# EAGLE design bare (EAGLE 9.3.2)
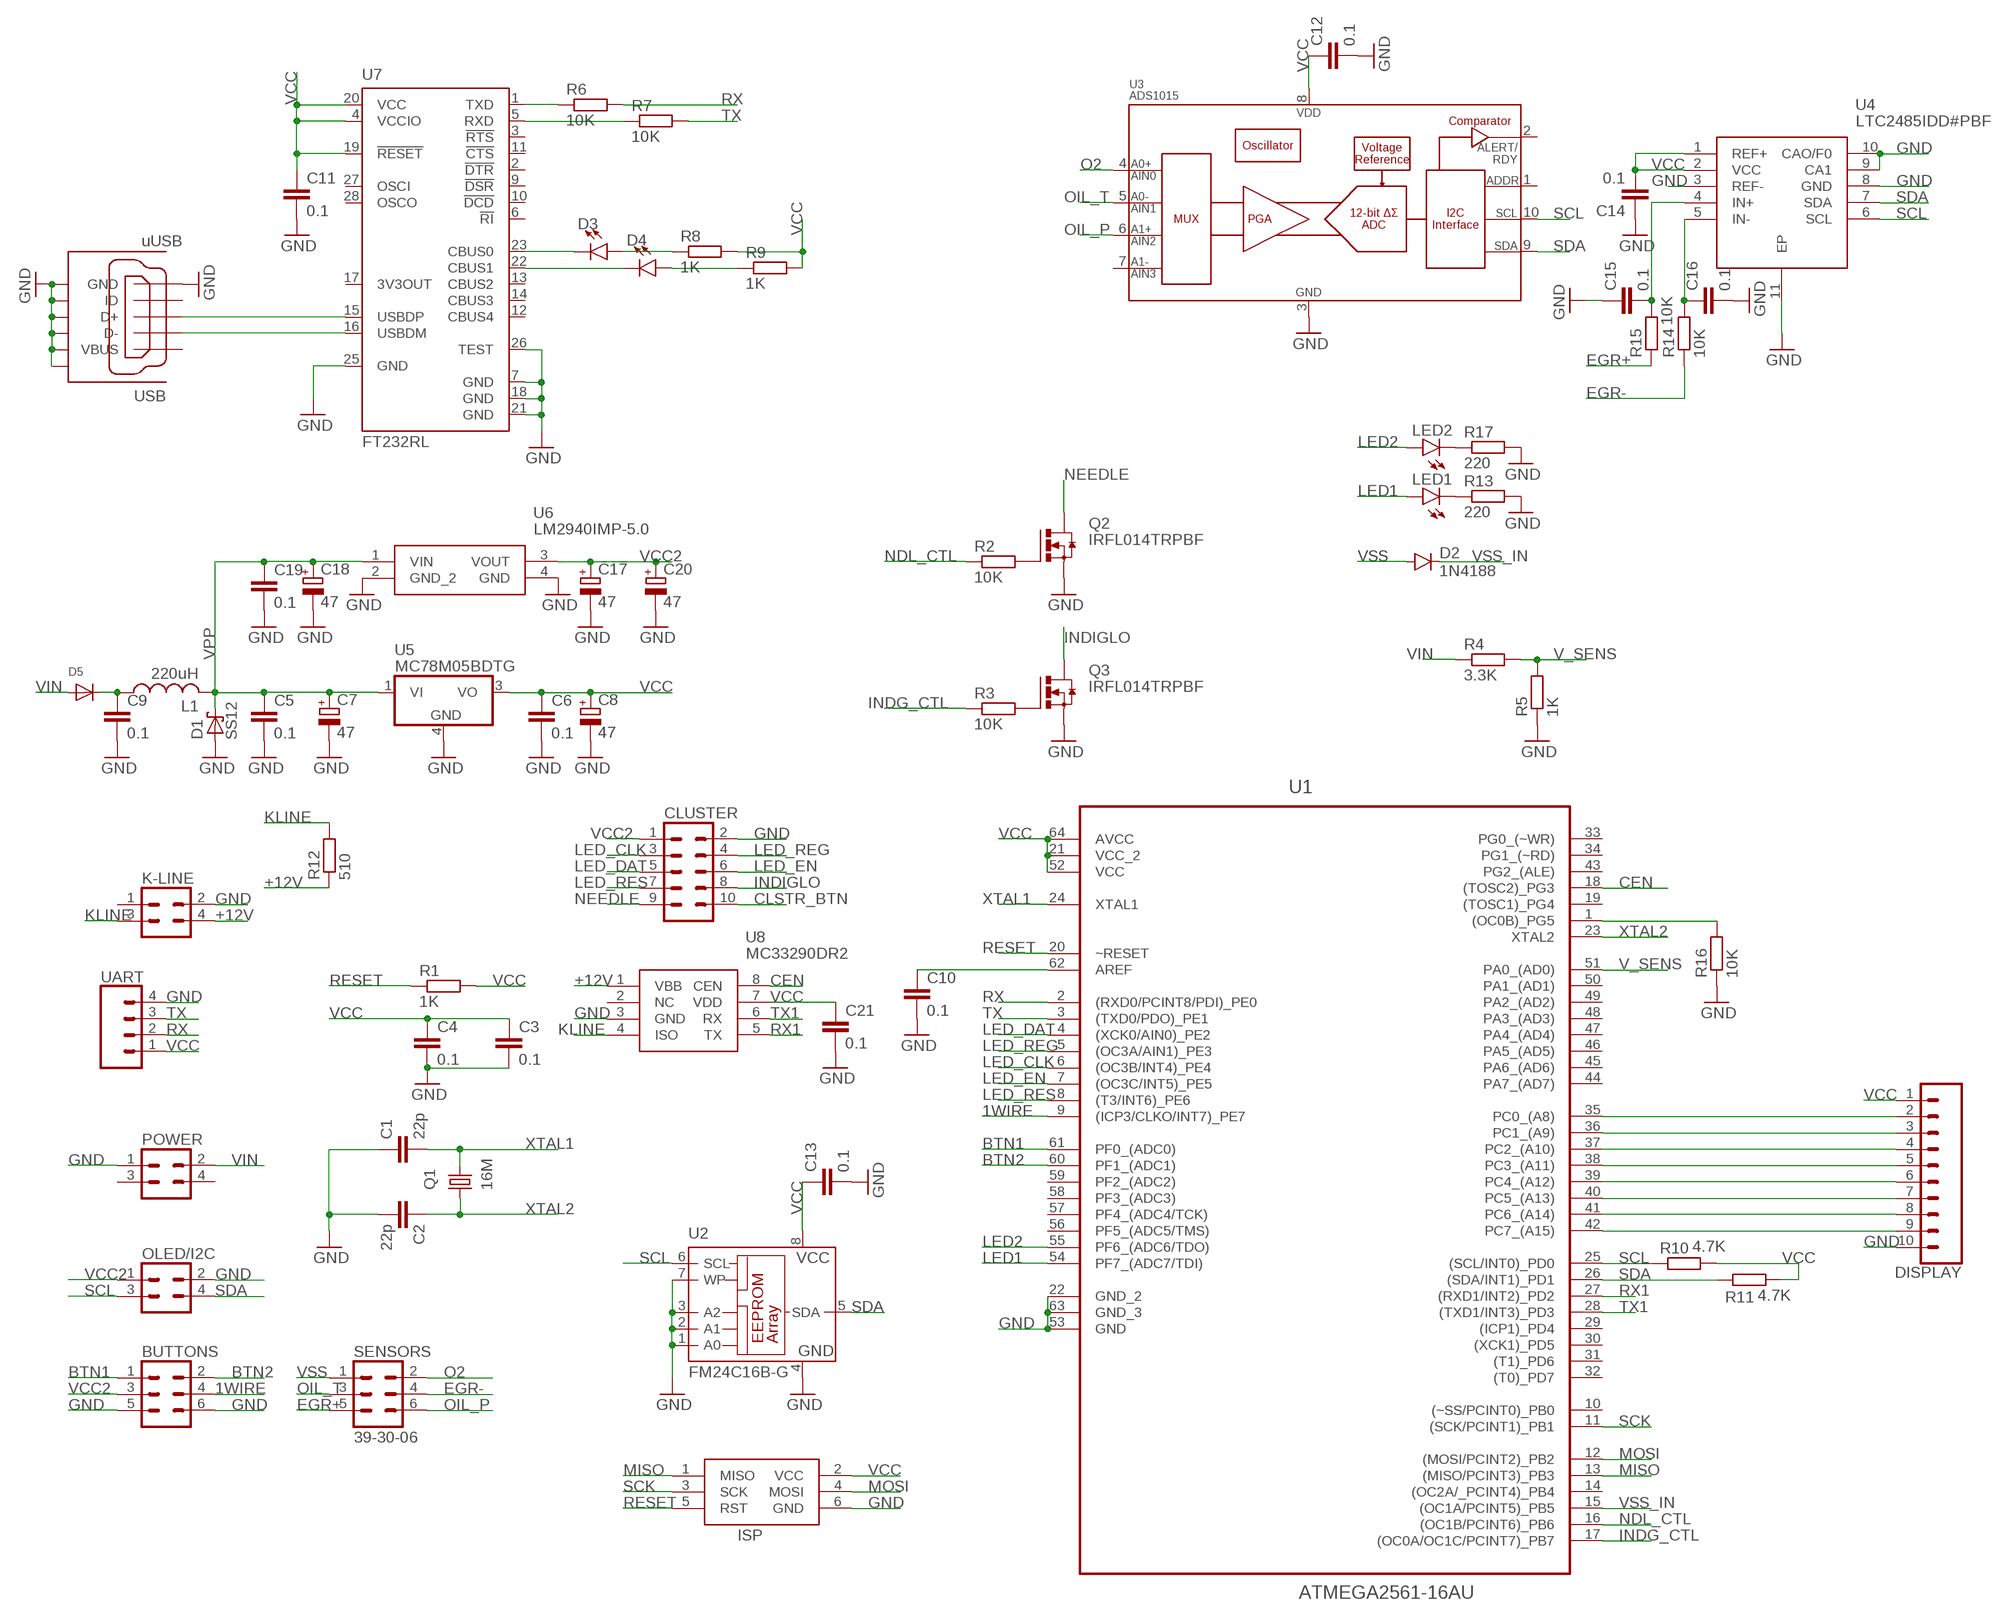
[diagram p0: schematic, sheet 1]

## Parts
BUTTONS  39-30-06  [39-30-?06?]
C1  22p  C-EUC0603K  [C0603K]
C2  22p  C-EUC0603K  [C0603K]
C3  0.1  C-EUC0603K  [C0603K]
C4  0.1  C-EUC0603K  [C0603K]
C5  0.1  C-EUC0805K  [C0805K]
C6  0.1  C-EUC0805K  [C0805K]
C7  47  CPOL-EUSMCC  [SMC_C]
C8  47  CPOL-EUSMCC  [SMC_C]
C9  0.1  C-EUC0805K  [C0805K]
C10  0.1  C-EUC0603K  [C0603K]
C11  0.1  C-EUC0603K  [C0603K]
C12  0.1  C-EUC0805K  [C0805K]
C13  0.1  C-EUC0603K  [C0603K]
C14  0.1  C-EUC0603K  [C0603K]
C15  0.1  C-EUC0603K  [C0603K]
C16  0.1  C-EUC0603K  [C0603K]
C17  47  CPOL-EUSMCC  [SMC_C]
C18  47  CPOL-EUSMCC  [SMC_C]
C19  0.1  C-EUC0805K  [C0805K]
C20  47  CPOL-EUSMCC  [SMC_C]
C21  0.1  C-EUC0603K  [C0603K]
CLUSTER  39-30-10  [39-30-?10?]
D1  SS12  BAS85  [SOD80C]
D2  1N4188  DIODESOD  [SOD-323]
D3  GREEN  LED-GREEN0603  [LED-0603]
D4  RED  LED-RED0603  [LED-0603]
D5  DIODESMA  [SMADIODE]
DISPLAY  CONN_10"  [1X10]
ISP  AVRISP-6  [AVRISP]
K-LINE  39-30-04  [39-30-?04?]
L1  220uH  L-USPIS2816  [PIS2816]
LED1  LEDCHIP-LED0805  [CHIP-LED0805]
LED2  LEDCHIP-LED0805  [CHIP-LED0805]
OLED/I2C  39-30-04  [39-30-?04?]
POWER  39-30-04  [39-30-?04?]
Q1  16M  KX-7  [3.2X2.5_KX-7]
Q2  IRFL014TRPBF  N-HEXFET-2D_SOT232-  [SOT223]
Q3  IRFL014TRPBF  N-HEXFET-2D_SOT232-  [SOT223]
R1  1K  R-EU_R0603  [R0603]
R2  10K  R-EU_R0603  [R0603]
R3  10K  R-EU_R0603  [R0603]
R4  3.3K  R-EU_R0603  [R0603]
R5  1K  R-EU_R0603  [R0603]
R6  10K  R-EU_R0603  [R0603]
R7  10K  R-EU_R0603  [R0603]
R8  1K  R-EU_R0603  [R0603]
R9  1K  R-EU_R0603  [R0603]
R10  4.7K  R-EU_R0603  [R0603]
R11  4.7K  R-EU_R0603  [R0603]
R12  510  R-EU_R0603  [R0603]
R13  220  R-EU_R0603  [R0603]
R14  10K  R-EU_R0603  [R0603]
R15  10K  R-EU_R0603  [R0603]
R16  10K  R-EU_R0603  [R0603]
R17  220  R-EU_R0603  [R0603]
SENSORS  39-30-06  [39-30-?06?]
U1  ATMEGA2561-16AU  [QFP80P1600X1600X120-64N]
U2  FM24C16B-G  24AA256SN  [SO-08]
U3  ADS1015  [MSOP10]
U4  LTC2485IDD#PBF  [SON50P300X300X80-11N]
U5  MC78M05BDTG  [DPACK_3]
U6  LM2940IMP-5.0  [SOT230P696X180-4N]
U7  FT232RL  [SSOP28]
U8  MC33290DR2  [SOIC127P600X175-8N]
UART  UART  CONN_04  [1X04]
USB  uUSB  GHI-CONNECTORS_10118192-0001LF  [GHI-CONNECTORS_10118192-0001LF(MICRO-USB-B-AMPHENOL-FCI)]

## Nets
1WIRE: BUTTONS.4 U1.9((ICP3/CLKO/INT7)_PE7)
+12V: K-LINE.4 R12.1 U8.1(VBB)
BTN1: BUTTONS.1 U1.61(PF0_(ADC0))
BTN2: BUTTONS.2 U1.60(PF1_(ADC1))
CEN: U1.18((TOSC2)_PG3) U8.8(CEN)
CLSTR_BTN: CLUSTER.10 R16.2 U1.1((OC0B)_PG5)
EGR+: R15.1 SENSORS.5
EGR-: R14.1 SENSORS.4
GND: BUTTONS.5 BUTTONS.6 C1.1 C2.2 C3.2 C4.2 C5.2 C6.2 C7.- C8.- C9.2 C10.2 C11.2 C12.2 C13.2 C14.1 C15.1 C16.2 C17.- C18.- C19.2 C20.- C21.2 CLUSTER.2 D1.2(A) DISPLAY.10 ISP.6(GND) K-LINE.2 OLED/I2C.2 POWER.1 Q2.3(S) Q3.3(S) R5.1 R13.2 R16.1 R17.2 U1.22(GND_2) U1.53(GND) U1.63(GND_3) U2.1(A0) U2.2(A1) U2.3(A2) U2.4(GND) U2.7(WP) U3.3(VSS) U4.3(REF-) U4.8(GND) U4.9(CA1) U4.10(CAO/F0) U4.11(EP) U5.4(GND) U6.2(GND_2) U6.4(GND) U7.7(GND) U7.18(GND) U7.21(GND) U7.25(GND) U7.26(TEST) U8.3(GND) UART.4 USB.CGND1(SGND1) USB.CGND2(SGND2) USB.CGND3(SGND3) USB.CGND4(SGND4) USB.CGND5(SGND5) USB.CGND6(SGND6) USB.GND
INDG_CTL: R3.1 U1.17((OC0A/OC1C/PCINT7)_PB7)
INDIGLO: CLUSTER.8 Q3.2(D) Q3.4(D)
KLINE: K-LINE.3 R12.2 U8.4(ISO)
LED1: LED1.A U1.54(PF7_(ADC7/TDI))
LED2: LED2.A U1.55(PF6_(ADC6/TDO))
LED_CLK: CLUSTER.3 U1.6((OC3B/INT4)_PE4)
LED_DAT: CLUSTER.5 U1.4((XCK0/AIN0)_PE2)
LED_EN: CLUSTER.6 U1.7((OC3C/INT5)_PE5)
LED_REG: CLUSTER.4 U1.5((OC3A/AIN1)_PE3)
LED_RES: CLUSTER.7 U1.8((T3/INT6)_PE6)
MISO: ISP.1(MISO) U1.13((MISO/PCINT3)_PB3)
MOSI: ISP.4(MOSI) U1.12((MOSI/PCINT2)_PB2)
N$1: Q2.1(G) R2.2
N$2: Q3.1(G) R3.2
N$3: C10.1 U1.62(AREF)
N$4: R6.1 U7.1(TXD)
N$5: R7.1 U7.5(RXD)
N$6: U7.15(USBDP) USB.D+
N$7: U7.16(USBDM) USB.D-
N$8: D3.C U7.23(CBUS0)
N$9: D4.C U7.22(CBUS1)
N$10: D3.A R8.1
N$11: D4.A R9.1
N$12: LED1.C R13.1
N$13: LED2.C R17.1
N$14: C9.1 D5.C L1.1
N$15: DISPLAY.9 U1.42(PC7_(A15))
N$16: C16.1 R14.2 U4.5(IN-)
N$17: C15.2 R15.2 U4.4(IN+)
N$18: DISPLAY.8 U1.41(PC6_(A14))
N$19: DISPLAY.7 U1.40(PC5_(A13))
N$20: DISPLAY.6 U1.39(PC4_(A12))
N$21: DISPLAY.5 U1.38(PC3_(A11))
N$22: DISPLAY.4 U1.37(PC2_(A10))
N$23: DISPLAY.3 U1.36(PC1_(A9))
N$24: DISPLAY.2 U1.35(PC0_(A8))
NDL_CTL: R2.1 U1.16((OC1B/PCINT6)_PB6)
NEEDLE: CLUSTER.9 Q2.2(D) Q2.4(D)
O2: SENSORS.2 U3.4(AIN0)
OIL_P: SENSORS.6 U3.6(AIN2)
OIL_T: SENSORS.3 U3.5(AIN1)
RESET: ISP.5(RST) R1.1 U1.20(~RESET)
RX: R6.2 U1.2((RXD0/PCINT8/PDI)_PE0) UART.2
RX1: U1.27((RXD1/INT2)_PD2) U8.5(TX)
SCK: ISP.3(SCK) U1.11((SCK/PCINT1)_PB1)
SCL: OLED/I2C.3 R10.1 U1.25((SCL/INT0)_PD0) U2.6(SCL) U3.10(SCL) U4.6(SCL)
SDA: OLED/I2C.4 R11.1 U1.26((SDA/INT1)_PD1) U2.5(SDA) U3.9(SDA) U4.7(SDA)
TX: R7.2 U1.3((TXD0/PDO)_PE1) UART.3
TX1: U1.28((TXD1/INT3)_PD3) U8.6(RX)
V_SENS: R4.2 R5.2 U1.51(PA0_(AD0))
VCC: C3.1 C4.1 C6.1 C8.+ C11.1 C12.1 C13.1 C14.2 C21.1 DISPLAY.1 ISP.2(VCC) R1.2 R8.2 R9.2 R10.2 R11.2 U1.21(VCC_2) U1.52(VCC) U1.64(AVCC) U2.8(VCC) U3.8(VDD) U4.1(REF+) U4.2(VCC) U5.3(VO) U7.4(VCCIO) U7.19(!RESET) U7.20(VCC) U8.7(VDD) UART.1
VCC2: BUTTONS.3 C17.+ C20.+ CLUSTER.1 OLED/I2C.1 U6.3(VOUT)
VIN: D5.A POWER.2 R4.1
VPP: C5.1 C7.+ C18.+ C19.1 D1.1(K) L1.2 U5.1(VI) U6.1(VIN)
VSS: D2.A SENSORS.1
VSS_IN: D2.C U1.15((OC1A/PCINT5)_PB5)
XTAL1: C1.2 Q1.3 U1.24(XTAL1)
XTAL2: C2.1 Q1.1 U1.23(XTAL2)
Unconnected: K-LINE.1 POWER.3 POWER.4 U1.10((~SS/PCINT0)_PB0) U1.14((OC2A/_PCINT4)_PB4) U1.19((TOSC1)_PG4) U1.29((ICP1)_PD4) U1.30((XCK1)_PD5) U1.31((T1)_PD6) U1.32((T0)_PD7) U1.33(PG0_(~WR)) U1.34(PG1_(~RD)) U1.43(PG2_(ALE)) U1.44(PA7_(AD7)) U1.45(PA6_(AD6)) U1.46(PA5_(AD5)) U1.47(PA4_(AD4)) U1.48(PA3_(AD3)) U1.49(PA2_(AD2)) U1.50(PA1_(AD1)) U1.56(PF5_(ADC5/TMS)) U1.57(PF4_(ADC4/TCK)) U1.58(PF3_(ADC3)) U1.59(PF2_(ADC2)) U3.1(ADDR) U3.2(ALERT/RDY) U3.7(AIN3) U7.2(!DTR) U7.3(!RTS) U7.6(!RI) U7.9(!DSR) U7.10(!DCD) U7.11(!CTS) U7.12(CBUS4) U7.13(CBUS2) U7.14(CBUS3) U7.17(3V3OUT) U7.27(OSCI) U7.28(OSCO) U8.2(NC) USB.ID USB.VBUS

## Library data of the parts
BUTTONS SENSORS = con-molex-mini-fit:39-30-?06?: HEADER
C1-C6 C9-C16 C19 C21 = rcl:C-EU: CAPACITOR, European symbol
C7 C8 C17 C18 C20 = rcl:CPOL-EU: POLARIZED CAPACITOR, European symbol; SPICEPREFIX: C
CLUSTER = con-molex-mini-fit:39-30-?10?: HEADER
D1 = NXP_60_26022015:BAS85: Schottky barrier diode Planar Schottky barrier diode with an integrated guard ring for stress protection, encapsulated in a small hermetically sealed glass SOD80C Surface-Mounted Device SMD package with tin-plated metal discs at each end. It is suitable for ?automatic placement? and as such it can withstand immersion soldering. AAL Eindhoven MK
D2 = BeagleBone_Blue_R3:DIODE: Diode; PROD_ID: DIO-09646
D3 = SparkFun-LED:LED-GREEN: Green SMD LED Used in manufacturing of various products at SparkFun Packages: 0603 - SMD 0603 package [Product Link] <http://www.futureelectronics.com/en/technologies/semiconductors/optoelectronics/leds/Pages/9894312-LTST-C190GKT.aspx?CrossPart=HSMG-C190&IM=0> LilyPad 1206 - SMD1206 LilyPad package [Product Link] <http://www.futureelectronics.com/en/Technologies/Product.aspx?ProductID=IN150NGHARVATEKCORPORATION2049943&IM=0> 1206 - SMD1206 package [Product Link] <http://www.futureelectronics.com/en/technologies/semiconductors/optoelectronics/leds/Pages/8315665-LTST-C150KGKT.aspx?IM=0> 1206 Bottom Mount -SMD 1206 Bottom Mount [Product Link] <http://www.digikey.com/product-detail/en/lite-on-inc/LTST-C230KGKT/160-1456-1-ND/386854> SparkFun Products: Pro Mini 328 -5V <https://www.sparkfun.com/products/821> RedBoard <https://www.sparkfun.com/products/12757> MP3 Trigger <https://www.sparkfun.com/products/13720> Makey Makey <https://www.sparkfun.com/products/11076>; PROD_ID: DIO-00821
D4 = SparkFun-LED:LED-RED: Red SMD LED Used in manufacturing of most products at SparkFun Packages: 0603 - SMD 0603 package [Product Link] <http://docs.avagotech.com/docs/AV02-0551EN> 0603 SMART - SMD 0603 SMART package ( more efficient and expensive)[Product Link] <http://www.osram-os.com/Graphics/XPic2/00077099_0.pdf> 1206 - SMD1206 package [Product Link] <https://www.sparkfun.com/datasheets/DevTools/LilyPad/Q150OVS4.pdff> SparkFun Products: Pro Mini 328 -5V <https://www.sparkfun.com/products/821> RedBoard <https://www.sparkfun.com/products/12757> IOIO-OTG <https://www.sparkfun.com/products/13613>; PROD_ID: DIO-00819
D5 = adafruit:DIODE: Diode
DISPLAY = SparkFun-Connectors:CONN_10: Multi connection point. Often used as Generic Header-pin footprint for 0.1 inch spaced/style header connections On any of the 0.1 inch spaced packages, you can populate with these: Break Away Headers - Straight <https://www.sparkfun.com/products/116> (PRT-00116) Break Away Male Headers - Right Angle <https://www.sparkfun.com/products/553> (PRT-00553) Female Headers <https://www.sparkfun.com/products/115> (PRT-00115) Break Away Headers - Machine Pin <https://www.sparkfun.com/products/117> (PRT-00117) Break Away Female Headers - Swiss Machine Pin <https://www.sparkfun.com/products/743> (PRT-00743) Arduino Stackable Header - 10 Pin <https://www.sparkfun.com/products/11376> (PRT-11376) For SCREWTERMINALS and SPRING TERMINALS visit here: Screw Terimnals on SparkFun.com <https://www.sparkfun.com/search/results?term=Screw+Terminals> (5mm/3.5mm/2.54mm spacing) This device is also useful as a general connection point to wire up your design to another part of your project. Our various solder wires solder well into these plated through hole pads. Hook-Up Wire - Assortment (Stranded, 22 AWG) <https://www.sparkfun.com/products/11375> (PRT-11375) Hook-Up Wire - Assortment (Solid Core, 22 AWG) <https://www.sparkfun.com/products/11367> (PRT-11367) View the entire wire category on our website here <https://www.sparkfun.com/categories/141> Special notes: Molex polarized connector foot print use with SKU : PRT-08231 with associated crimp pins and housings. 1MM SMD Version SKU: PRT-10208 NOTES ON THE VARIANTS LOCK and LOCK_LONGPADS... This footprint was designed to help hold the alignment of a through-hole component (i.e. 6-pin header) while soldering it into place. You may notice that each hole has been shifted either up or down by 0.005 of an inch from it's more standard position (which is a perfectly straight line). This slight alteration caused the pins (the squares in the middle) to touch the edges of the holes. Because they are alternating, it causes a "brace" to hold the component in place. 0.005 has proven to be the perfect amount of "off-center" position when using our standard breakaway headers. Although looks a little odd when you look at the bare footprint, once you have a header in there, the alteration is very hard to notice. Also,if you push a header all the way into place, it is covered up entirely on the bottom side.; PROD_ID: CONN-11563
ISP = adafruit:AVRISP: AVR ISP HEADER Standard 6 pin header for AVR programming
K-LINE OLED/I2C POWER = con-molex-mini-fit:39-30-?04?: HEADER
L1 = rcl:L-US: INDUCTOR, American symbol; SPICEPREFIX: L
LED1 LED2 = led:LED: LED OSRAM: - CHIPLED LG R971, LG N971, LY N971, LG Q971, LY Q971, LO R971, LY R971 LH N974, LH R974 LS Q976, LO Q976, LY Q976 LO Q996 - Hyper CHIPLED LW Q18S LB Q993, LB Q99A, LB R99A - SideLED LS A670, LO A670, LY A670, LG A670, LP A670 LB A673, LV A673, LT A673, LW A673 LH A674 LY A675 LS A676, LA A676, LO A676, LY A676, LW A676 LS A679, LY A679, LG A679 - Hyper Micro SIDELED® LS Y876, LA Y876, LO Y876, LY Y876 LT Y87S - SmartLED LW L88C, LW L88S LB L89C, LB L89S, LG L890 LS L89K, LO L89K, LY L89K LS L896, LA L896, LO L896, LY L896 - TOPLED LS T670, LO T670, LY T670, LG T670, LP T670 LSG T670, LSP T670, LSY T670, LOP T670, LYG T670 LG T671, LOG T671, LSG T671 LB T673, LV T673, LT T673, LW T673 LH T674 LS T676, LA T676, LO T676, LY T676, LB T676, LH T676, LSB T676, LW T676 LB T67C, LV T67C, LT T67C, LS T67K, LO T67K, LY T67K, LW E67C LS E67B, LA E67B, LO E67B, LY E67B, LB E67C, LV E67C, LT E67C LW T67C LS T679, LY T679, LG T679 LS T770, LO T770, LY T770, LG T770, LP T770 LB T773, LV T773, LT T773, LW T773 LH T774 LS E675, LA E675, LY E675, LS T675 LS T776, LA T776, LO T776, LY T776, LB T776 LHGB T686 LT T68C, LB T68C - Hyper Mini TOPLED® LB M676 - Mini TOPLED Santana® LG M470 LS M47K, LO M47K, LY M47K Source: http://www.osram.convergy.de LUXEON: - LUMILED® LXK2-PW12-R00, LXK2-PW12-S00, LXK2-PW14-U00, LXK2-PW14-V00 LXK2-PM12-R00, LXK2-PM12-S00, LXK2-PM14-U00 LXK2-PE12-Q00, LXK2-PE12-R00, LXK2-PE12-S00, LXK2-PE14-T00, LXK2-PE14-U00 LXK2-PB12-K00, LXK2-PB12-L00, LXK2-PB12-M00, LXK2-PB14-N00, LXK2-PB14-P00, LXK2-PB14-Q00 LXK2-PR12-L00, LXK2-PR12-M00, LXK2-PR14-Q00, LXK2-PR14-R00 LXK2-PD12-Q00, LXK2-PD12-R00, LXK2-PD12-S00 LXK2-PH12-R00, LXK2-PH12-S00 LXK2-PL12-P00, LXK2-PL12-Q00, LXK2-PL12-R00 Source: www.luxeon.com KINGBRIGHT: KA-3528ASYC Source: www.kingbright.com
Q1 = crystal-geyer_V1_0:KX: Quartz Crystals (MHz) SMD: KX - Serie Model Size l/w/h [mm] Frequency Range Frequency Stability Temp. Range [°C] Load Capacitance AECQ 200 availabel Datasheet KX-4 KX-5 KX-6 KX-7 KX-9A KX-9B KX-12A KX-12B KX-13 KX-20 KX-K KX-KS 1.6/1.2/0.3 2.0/1.6/0.45 2.5/2.0/0.55 3.2/2.5/0.8 5.0/3.2/1.0 5.0/3.2/1.1 6.0/3.5/1.1 6.0/3.5/1.0 7.0/5.0 /1.3 11.6/5.5/1.6 12.3/4.5/4.2 12.3/4.5/3.2 24.0 ~ 80.0 MHz 16.0 ~ 80.0 MHz 12.0 ~ 80.0 MHz 8.0 ~ 60.0 MHz 7,68 ~ 300,0 MHz 8,0 ~ 50,0 MHz 8,0 ~ 150,0 MHz 8,0 ~ 50,0 MHz 6,0 ~ 160,0 MHz 3,579 ~ 25,0 MHz 3,579 ~ 70,0 MHz 3,579 ~ 70,0 MHz ±10 … ±50ppm ±10 … ±50ppm ±10 … ±50ppm ±10 … ±50ppm ±10 … ±50ppm ±10 … ±50ppm ±10 … ±50ppm ±10 … ±50ppm ±10 … ±50ppm ±50ppm ±10 … ±50ppm ±10 … ±50ppm (*) -40°C …+85°C (*) -40°C …+125°C (*) -40°C …+125°C (*) -40°C …+125°C (*) -40°C …+105°C (*) -40°C …+105°C (*) -40°C …+125°C (*) -40°C …+105°C (*) -40°C …+105°C (*) -40°C …+105°C (*) -40°C …+85°C (*) -40°C …+85°C 8, 8…16 8, 8…16 10, 8…16 12, 7…20 16, 10…20 16, 10…20 16, 10…20 16, 12…20 16, 12…20 16, 12…20 16, 12…30 16, 12…30 - yes yes yes - - - - - - - - KX-4.pdf <http://www.geyer-electronic.de/uploads/tx_userartikelfrequenz/GEYER-KX-4.pdf> KX-5.pdf <http://www.geyer-electronic.de/uploads/tx_userartikelfrequenz/GEYER-KX-5.pdf> KX-6.pdf <http://www.geyer-electronic.de/uploads/tx_userartikelfrequenz/GEYER-KX-6.pdf> KX-7.pdf <http://www.geyer-electronic.de/uploads/tx_userartikelfrequenz/GEYER-KX-7.pdf> KX-9A.pdf <http://www.geyer-electronic.de/uploads/tx_userartikelfrequenz/GEYER-KX-9A.pdf> KX-9B.pdf <http://www.geyer-electronic.de/uploads/tx_userartikelfrequenz/GEYER-KX-9B.pdf> KX-12A.pdf <http://www.geyer-electronic.de/uploads/tx_userartikelfrequenz/GEYER-KX-12A.pdf> KX-12B.pdf <http://www.geyer-electronic.de/uploads/tx_userartikelfrequenz/GEYER-KX-12B.pdf> KX-13.pdf <http://www.geyer-electronic.de/uploads/tx_userartikelfrequenz/GEYER-KX-13.pdf> KX-20.pdf <http://www.geyer-electronic.de/uploads/tx_userartikelfrequenz/GEYER-KX-20.pdf> KX-K.pdf <http://www.geyer-electronic.de/uploads/tx_userartikelfrequenz/GEYER-KX-K.pdf> KX-KS.pdf <http://www.geyer-electronic.de/uploads/tx_userartikelfrequenz/GEYER-KX-KS.pdf> <http://www.geyer-electronic.de/fileadmin/template/img/logo-geyer-electronic.png> Details see: http://www.geyer-electronic.de/Frequenz-Produkte.9.0.html Created 2016-06-07, Hans Locher 2016 (C) Geyer Quartz Technology KX4,KX5,KX6,KX7,KX9A,KX9B,KX12A,KX12B,KX13,KX20,KXK,KXKS;1612;2016;2520;3225;5032;6035;7050;11655;12345;1,6x1,2;2,0x1,6;2,5x2,0;3,2x2,5;5,0x3,2;6,0x3,5;7,0x5,0;11,6x5,5;12,3x4,5;12,3x4,5;1.6x1.2;2.0x1.6;2.5x2.0;3.2x2.5;5.0x3.2;6.0x3.5;7.0x5.0;11.6x5.5;12.3x4.5;12.3x4.5;
Q2 Q3 = transistor-power:N-HEXFET-2D_?-*: HEXFET® Power MOSFET 2 Drain connects http://www.irf.com/product-info/datasheets/data/irll014n.pdf
R1-R17 = rcl:R-EU_: RESISTOR, European symbol; SPICEPREFIX: R
U1 = Atmel_By_element14_Batch_1-00:ATMEGA2561-16AU: Microcontroller; DESCRIPTION: Microcontroller; MPN: ATMEGA2561-16AU; OC_FARNELL: 1288332; OC_NEWARK: 23M5053; PACKAGE: QFP-64; SUPPLIER: ATMEL
U2 = microchip:24*: Serial EEPROM I2C; MPN: 24AA256T-I/SM; OC_FARNELL: 1579570; OC_NEWARK: 08N6838
U3 = SparkFun-IC-Conversion:ADS1015: ADS1015 12-BIT ADC 12-Bit Del-Sig ADC Four single-ended inputs or two differential inputs Internal PGA I2C interface 2.0-5.5V SparkFun Products SparkFun Block for Intel Edison - ADC <https://www.sparkfun.com/products/13770> (DEV-13770); PROD_ID: IC-12270
U4 = LTC2485IDD:LTC2485IDD#PBF: ADC 24-bit Delta-Sigma Serial DFN10 EP Linear Technology LTC2485IDD#PBF, 24 bit Serial ADC, Differential Input, 10-Pin DFN Source: Datasheet <http://uk.rs-online.com/web/p/products/8842603>; DESCRIPTION: ADC 24-bit Delta-Sigma Serial DFN10 EP Linear Technology LTC2485IDD#PBF, 24 bit Serial ADC, Differential Input, 10-Pin DFN; HEIGHT: 0.8mm; MANUFACTURER_NAME: Linear Technology; MANUFACTURER_PART_NUMBER: LTC2485IDD#PBF; RS_PART_NUMBER: 1580322; RS_PRICE-STOCK: http://uk.rs-online.com/web/p/products/1580322
U5 = linear:MC78M: 500 mA Positive Voltage Regulators Source: Data sheet <http://www.onsemi.com/pub_link/Collateral/MC78M00-D.PDF>
U6 = LM2940IMP-5.0:LM2940IMP-5.0: Low Dropout Regulator Source: Datasheet; DESCRIPTION: Low Dropout Regulator; HEIGHT: mm; MANUFACTURER_NAME: Texas Instruments; MANUFACTURER_PART_NUMBER: LM2940IMP-5.0; MOUSER_PART_NUMBER: 926-LM2940IMP-50; MOUSER_PRICE-STOCK: https://www.mouser.com/Search/Refine.aspx?Keyword=926-LM2940IMP-50
U7 = ftdichip:FT232R: Source: http://www.ftdichip.com/Documents/DataSheets/DS_FT232R_v104.pdf; MPN: FT232RL; OC_FARNELL: 1146032; OC_NEWARK: 91K9918
U8 = MC33290DR2:MC33290DR2: Interface - Specialized ISO LINK IC Source: Datasheet <https://www.mouser.com/catalog/specsheets/mc33290.pdf>; DESCRIPTION: Interface - Specialized ISO LINK IC; HEIGHT: 1.75mm; MANUFACTURER_NAME: Nexperia; MANUFACTURER_PART_NUMBER: MC33290DR2; MOUSER_PART_NUMBER: N/A; MOUSER_PRICE-STOCK: https://www.mouser.com/Search/Refine.aspx?Keyword=N%2FA
UART = SparkFun-Connectors:CONN_04: Multi connection point. Often used as Generic Header-pin footprint for 0.1 inch spaced/style header connections On any of the 0.1 inch spaced packages, you can populate with these: Break Away Headers - Straight <https://www.sparkfun.com/products/116> (PRT-00116) Break Away Male Headers - Right Angle <https://www.sparkfun.com/products/553> (PRT-00553) Female Headers <https://www.sparkfun.com/products/115> (PRT-00115) Break Away Headers - Machine Pin <https://www.sparkfun.com/products/117> (PRT-00117) Break Away Female Headers - Swiss Machine Pin <https://www.sparkfun.com/products/743> (PRT-00743) For SCREWTERMINALS and SPRING TERMINALS visit here: Screw Terimnals on SparkFun.com <https://www.sparkfun.com/search/results?term=Screw+Terminals> (5mm/3.5mm/2.54mm spacing) This device is also useful as a general connection point to wire up your design to another part of your project. Our various solder wires solder well into these plated through hole pads. Hook-Up Wire - Assortment (Stranded, 22 AWG) <https://www.sparkfun.com/products/11375> (PRT-11375) Hook-Up Wire - Assortment (Solid Core, 22 AWG) <https://www.sparkfun.com/products/11367> (PRT-11367) View the entire wire category on our website here <https://www.sparkfun.com/categories/141> Special notes: Molex polarized connector foot print use with SKU : PRT-08231 with associated crimp pins and housings. 1MM SMD Version SKU: PRT-10208; PROD_ID: CONN-09696
USB = BeagleBone_Black_Wireless:GHI-CONNECTORS_10118192-0001LF: Amphenol FCI Micro USB Type B Complete Surface Mount (SMT) no guide holes

## Board
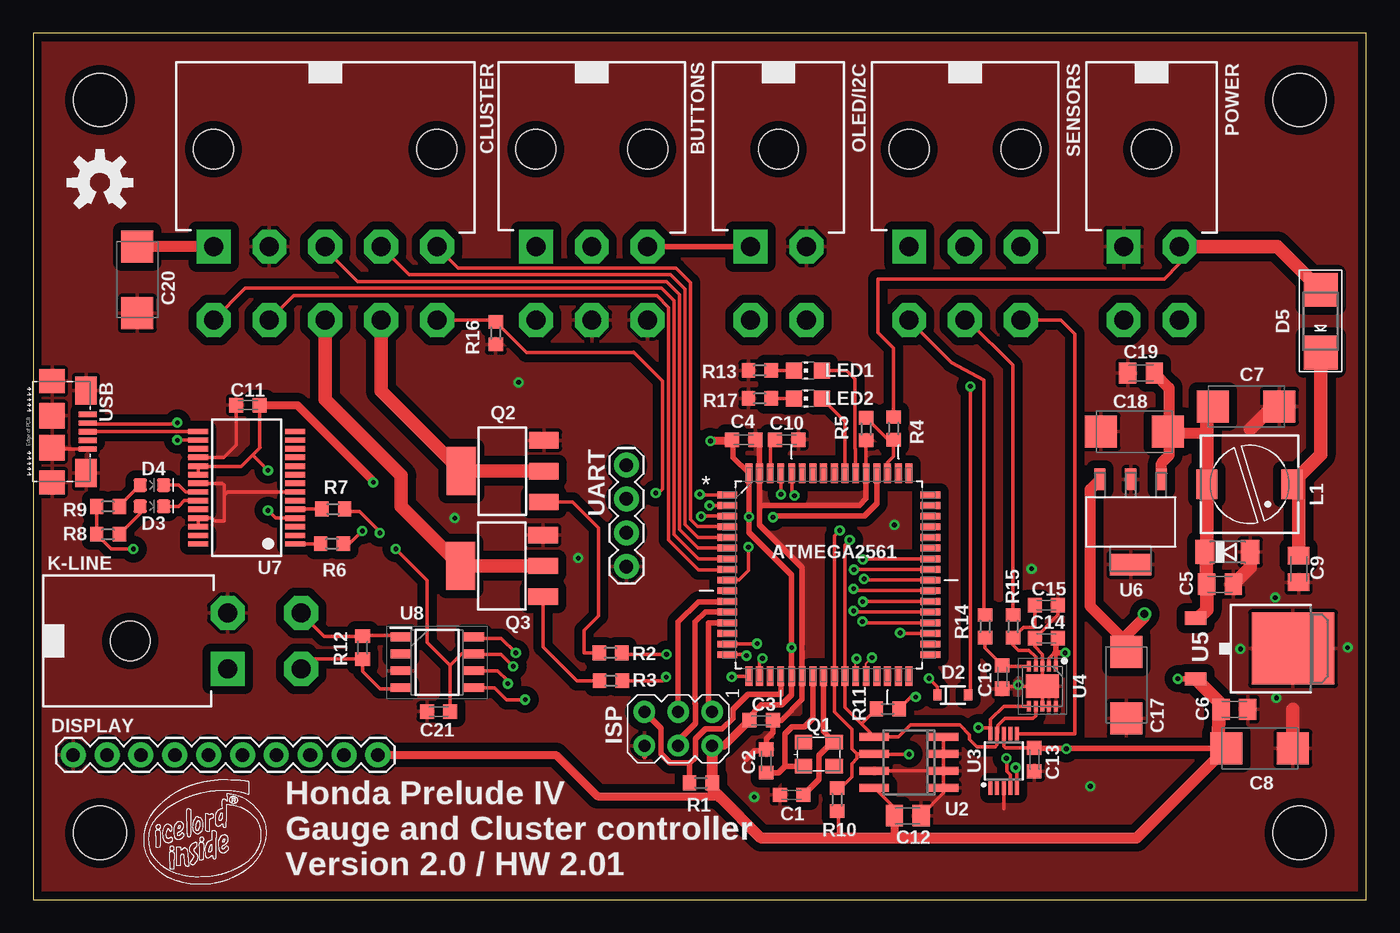
[diagram p1: board, top side]
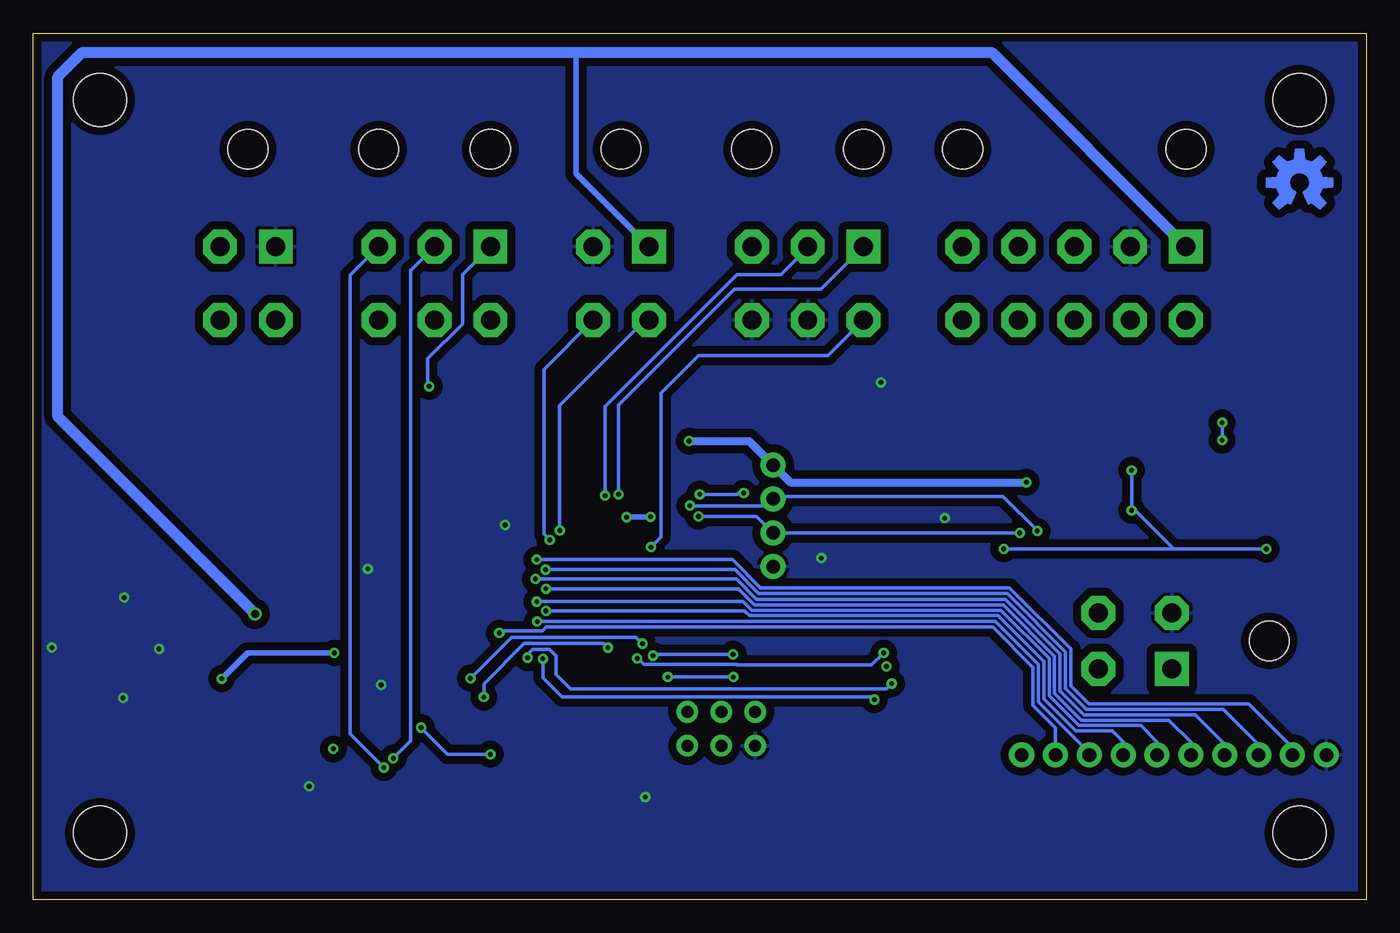
[diagram p2: board, bottom side, seen from below]

Size 100 x 65 mm. Coordinates in mm from the lower left corner, seen from the top.
Outline: 0,0 100,0 100,65 0,65 0,0
Copper layers (1*16): Top 0.035mm / dielectric 1.5mm / Bottom 0.035mm
Design rules "default *": minimum track width 6mil, minimum drill 0.35mm, track to track 6mil, track to pad 6mil, pad to pad 6mil, via to via 6mil, smd to smd 6mil, copper to edge 0.1mm, drill to drill 6mil, minimum pad ring 10mil, minimum via ring 8mil, stop-mask expansion 0.1mm, vias tented up to drill 1mm, thermal gap 10mil
Holes 4 mm at 5,60 5,5 95,5 95,60

### Footprints (pad centres in the part's own frame; a part is rotated, then mirrored left to right if it is on the bottom)
39-30-?06? = drill 1.422 pad 2.54 square: 1 4.191,0 | drill 1.422 pad 2.54 octagon: 2 0,0; 3 -4.191,0; 4 4.191,5.512; 5 0,5.512; 6 -4.191,5.512 | hole 3: -4.191,-7.3; 4.191,-7.3
C0603K = smd 1.05 x 1.08: 1 -0.875,0; 2 0.875,0
C0805K = smd 1.3 x 1.6: 1 -1,0; 2 1,0
SMC_C = smd 2.4 x 2.4: + -2.5,0; - 2.5,0
39-30-?10? = drill 1.422 pad 2.54 square: 1 8.382,0 | drill 1.422 pad 2.54 octagon: 2 4.191,0; 3 0,0; 4 -4.191,0; 5 -8.382,0; 6 8.382,5.512; 7 4.191,5.512; 8 0,5.512; 9 -4.191,5.512; 10 -8.382,5.512 | hole 3: -8.382,-7.3; 8.382,-7.3
SOD80C = smd 1.4 x 1.8: 1 -1.7,0; 2 1.7,0
SOD-323 = smd 0.63 x 0.83: A 1.15,0; C -1.15,0
LED-0603 = smd 1 x 1: A -0.877,0; C 0.877,0
SMADIODE = smd 2.54 x 2.54: A 2.349,0; C -2.349,0
1X10 = drill 1.016 pad 1.88: 1 0,0; 2 2.54,0; 3 5.08,0; 4 7.62,0; 5 10.16,0; 6 12.7,0; 7 15.24,0; 8 17.78,0; 9 20.32,0; 10 22.86,0
AVRISP = drill 0.9 pad 1.626: 1 -1.27,2.54; 2 1.27,2.54; 3 -1.27,0; 4 1.27,0; 5 -1.27,-2.54; 6 1.27,-2.54
39-30-?04? = drill 1.422 pad 2.54 square: 1 2.095,0 | drill 1.422 pad 2.54 octagon: 2 -2.095,0; 3 2.095,5.512; 4 -2.095,5.512 | hole 3: 0,-7.3
PIS2816 = smd 2.2 x 1.6: 1 0,3.2; 2 0,-3.2
CHIP-LED0805 = smd 1.2 x 1.2: A 0,-1.05; C 0,1.05
3.2X2.5_KX-7 = smd 1.3 x 1.1: 1 -1.15,-0.9; 2 1.15,-0.9; 3 1.15,0.9; 4 -1.15,0.9
SOT223 = smd 1.219 x 2.235: 1 -2.311,-3.099; 2 0,-3.099; 3 2.311,-3.099 | smd 3.6 x 2.2: 4 0,3.099
R0603 = smd 1 x 1.1: 1 -0.85,0; 2 0.85,0
QFP80P1600X1600X120-64N = smd 1.473 x 0.508: 1 -7.62,5.994; 2 -7.62,5.207; 3 -7.62,4.394; 4 -7.62,3.607; 5 -7.62,2.794; 6 -7.62,2.007; 7 -7.62,1.194; 8 -7.62,0.406; 9 -7.62,-0.406; 10 -7.62,-1.194; 11 -7.62,-2.007; 12 -7.62,-2.794; 13 -7.62,-3.607; 14 -7.62,-4.394; 15 -7.62,-5.207; 16 -7.62,-5.994; 33 7.62,-5.994; 34 7.62,-5.207; 35 7.62,-4.394; 36 7.62,-3.607; 37 7.62,-2.794; 38 7.62,-2.007; 39 7.62,-1.194; 40 7.62,-0.406; 41 7.62,0.406; 42 7.62,1.194; 43 7.62,2.007; 44 7.62,2.794; 45 7.62,3.607; 46 7.62,4.394; 47 7.62,5.207; 48 7.62,5.994 | smd 0.508 x 1.473: 17 -5.994,-7.62; 18 -5.207,-7.62; 19 -4.394,-7.62; 20 -3.607,-7.62; 21 -2.794,-7.62; 22 -2.007,-7.62; 23 -1.194,-7.62; 24 -0.406,-7.62; 25 0.406,-7.62; 26 1.194,-7.62; 27 2.007,-7.62; 28 2.794,-7.62; 29 3.607,-7.62; 30 4.394,-7.62; 31 5.207,-7.62; 32 5.994,-7.62; 49 5.994,7.62; 50 5.207,7.62; 51 4.394,7.62; 52 3.607,7.62; 53 2.794,7.62; 54 2.007,7.62; 55 1.194,7.62; 56 0.406,7.62; 57 -0.406,7.62; 58 -1.194,7.62; 59 -2.007,7.62; 60 -2.794,7.62; 61 -3.607,7.62; 62 -4.394,7.62; 63 -5.207,7.62; 64 -5.994,7.62
SO-08 = smd 0.6 x 2.2: 1 -1.905,-2.6; 2 -0.635,-2.6; 3 0.635,-2.6; 4 1.905,-2.6; 5 1.905,2.6; 6 0.635,2.6; 7 -0.635,2.6; 8 -1.905,2.6
MSOP10 = smd 0.3 x 1: 1 -1,-2.05; 2 -0.5,-2.05; 3 0,-2.05; 4 0.5,-2.05; 5 1,-2.05; 6 1,2.05; 7 0.5,2.05; 8 0,2.05; 9 -0.5,2.05; 10 -1,2.05
SON50P300X300X80-11N = smd 0.8 x 0.3: 1 -1.5,1; 2 -1.5,0.5; 3 -1.5,0; 4 -1.5,-0.5; 5 -1.5,-1; 6 1.5,-1; 7 1.5,-0.5; 8 1.5,0; 9 1.5,0.5; 10 1.5,1 | smd 1.75 x 2.48: 11 0,0
DPACK_3 = smd 1 x 1.6: 1 -2.28,-4.8; 3 2.28,-4.8 | smd 5.4 x 6.2: 4 0,2.5
SOT230P696X180-4N = smd 1.6 x 0.838: 1 -3.2,2.311; 2 -3.2,0; 3 -3.2,-2.311 | smd 1.6 x 3.099: 4 3.2,0
SSOP28 = smd 0.4 x 1.5: 1 -4.225,-3.625; 2 -3.575,-3.625; 3 -2.925,-3.625; 4 -2.275,-3.625; 5 -1.625,-3.625; 6 -0.975,-3.625; 7 -0.325,-3.625; 8 0.325,-3.625; 9 0.975,-3.625; 10 1.625,-3.625; 11 2.275,-3.625; 12 2.925,-3.625; 13 3.575,-3.625; 14 4.225,-3.625; 15 4.225,3.625; 16 3.575,3.625; 17 2.925,3.625; 18 2.275,3.625; 19 1.625,3.625; 20 0.975,3.625; 21 0.325,3.625; 22 -0.325,3.625; 23 -0.975,3.625; 24 -1.625,3.625; 25 -2.275,3.625; 26 -2.925,3.625; 27 -3.575,3.625; 28 -4.225,3.625
SOIC127P600X175-8N = smd 1.55 x 0.65: 1 -2.725,1.905; 2 -2.725,0.635; 3 -2.725,-0.635; 4 -2.725,-1.905; 5 2.725,-1.905; 6 2.725,-0.635; 7 2.725,0.635; 8 2.725,1.905
1X04 = drill 1.016 pad 1.88: 1 0,0; 2 2.54,0; 3 5.08,0; 4 7.62,0
GHI-CONNECTORS_10118192-0001LF(MICRO-USB-B-AMPHENOL-FCI) = smd 1.8 x 1.9: CGND1 -3.8,0; CGND4 3.8,0 | smd 1.9 x 1.9: CGND2 -1.2,0; CGND3 1.2,0 | smd 2.1 x 1.6: CGND5 3.1,2.55; CGND6 -3.1,2.55 | smd 0.4 x 1.35: D+ 0,2.675; D- -0.65,2.675; GND 1.3,2.675; ID 0.65,2.675; VBUS -1.3,2.675

### Placement (x,y rotation side)
BUTTONS  41.9,49 180 top
C1  56.9,7.86 0 top
C2  54.99,10.4 90 top
C3  54.61,13.45 0 top
C4  53.29,34.5 0 top
C5  89.03,23.66 0 top
C6  90.11,14.26 0 top
C7  90.99,37 0 top
C8  92.01,11.34 0 top
C9  94.93,24.8 270 top
C10  56.52,34.5 0 top
C11  16.1,37.1 180 top
C12  65.6,6.3 0 top
C13  75.1,10.5 270 top
C14  76,19.6 0 top
C15  76,22.1 180 top
C16  72.7,16.7 270 top
C17  82,16.1 270 top
C18  82.6,35.1 180 top
C19  83.1,39.5 180 top
C20  7.8,46.5 270 top
C21  30.4,14.1 180 top
CLUSTER  21.9,49 180 top
D1  89.6,26.07 0 top
D2  68.98,15.34 0 top
D3  8.9,29.5 0 top
D4  8.9,31.1 0 top
D5  96.58,43.4 90 top
DISPLAY  25.85,10.85 180 top
ISP  48.39,12.81 270 top
K-LINE  14.57,19.41 270 top
L1  91.25,31.15 270 top
LED1  58.1,39.7 90 top
LED2  58.1,37.6 90 top
OLED/I2C  55.9,49 180 top
POWER  83.9,49 180 top
Q1  58.93,10.91 0 top
Q2  35.2,32.15 90 top
Q3  35.15,25.04 90 top
R1  50.08,8.75 0 top
R2  43.31,18.51 180 top
R3  43.33,16.42 180 top
R4  64.54,35.35 270 top
R5  62.48,35.3 90 top
R6  22.4,26.7 0 top
R7  22.5,29.3 0 top
R8  5.6,27.4 180 top
R9  5.6,29.5 180 top
R10  60.3,7.5 270 top
R11  64.1,14.3 0 top
R12  24.7,18.9 270 top
R13  54.5,39.7 180 top
R14  71.4,20.5 270 top
R15  73.5,20.5 270 top
R16  34.7,42.5 90 top
R17  54.5,37.6 180 top
SENSORS  39-30-06?  [39-30-?06?]  69.9,49 180 top
U1  59.69,24.37 0 top
U2  65.7,10.28 90 top
U3  72.8,10.4 0 top
U4  75.7,16 270 top
U5  92.01,18.83 270 top
U6  82.33,28.33 270 top
U7  16,30.9 90 top
U8  30.3,17.8 0 top
U$1  [ICELORD_SMALL]  7.89,0.77 0 top
U$2  [OSHW-LOGO-M]  5,53.8 0 top
U$3  [OSHW-LOGO-M_COPPER]  5,53.8 0 bottom
UART  44.49,32.6 270 top
USB  1.4,35.1 270 top

### Tracks (layer width: path | path; a pad name or v marks a point on that pad's centre or on a via)
1WIRE  (via drill 0.35)
  Top 0.254: v53.65,26.45 53.65,24.68 52.93,23.96 U1.9
  Bottom 0.254: BUTTONS.4 40.4,40.8 50.1,40.8 52.9,38 52.9,27.2 v53.65,26.45
+12V
  Top 0.254: K-LINE.4 21.84,19.75 R12.1 24.75,19.8 27.47,19.8 U8.1
BTN1  (via drill 0.35)
  Top 0.254: v56.09,30.4 v56.08,30.41 U1.61
  Bottom 0.254: BUTTONS.1 40.91,45.8 47.4,45.8 56.09,37.11 v56.09,30.4
BTN2  (via drill 0.35)
  Top 0.254: v57.1,30.31 56.9,30.51 U1.60
  Bottom 0.254: BUTTONS.2 41.9,48.9 43.9,46.9 47.2,46.9 57.1,37 v57.1,30.31
CEN  (via drill 0.35)
  Top 0.254: U1.18 54.48,17.88 v54.7,18.1 | v36.2,18.5 35.09,19.6 33.12,19.6 U8.8
  Bottom 0.254: v54.7,18.1 54.63,18.1 54.17,17.64 47.24,17.64 47.2,17.6 37.1,17.6 v36.2,18.5
CLSTR_BTN  (via drill 0.35)
  Top 0.254: U1.1 50.04,30.36 v50,30.4 | v46.7,30.5 46.9,30.5 47.2,30.8 47.2,38.9 45.03,41.07 45.03,41.05 37,41.05 R16.2 34.56,43.49 CLUSTER.10
  Bottom 0.254: v50,30.4 47.2,30.4 47.1,30.5 v46.7,30.5
EGR+
  Top 0.254: R15.1 73.5,40.09 70.17,43.41 SENSORS.5
EGR-
  Top 0.254: R14.1 71.3,21.45 71.3,39 68.89,40.3 SENSORS.4
GND  (via drill 0.35)
  Top 0.254: U1.53 R5.1 | U2.7 U2.2 | U2.2 U2.1 68.3,8 C12.2 | U2.2 U2.3 U2.4 | 11.71,33.2 12.35,33.2 U7.18 14.28,33.17 15.2,34.1 15.2,37.07 C11.2 | 12.3,31.3 U7.21 14.18,31.22 14.3,31.1 14.3,30.3 | C16.2 72.88,16 U4.11 | U4.11 U4.8 U4.9 | U4.11 U4.3 75.7,18.4 75.12,18.97 C14.1 76.88,21.35 C15.1 | U7.26 U7.25 13.38,28.62 13.6,28.4 14.3,28.4 14.3,30.3 | U7.7 14.58,30.57 14.3,30.3 | USB.GND 1.5,33.8 USB.CGND3 | U3.3 72.8,6.8
  Top 0.406: 56.12,13.45 57.68,15.01 U1.22 57.68,24.91 54.48,28.11 54.48,29.45 | 54.48,29.45 U1.63 54.48,34.49 C4.2 | U1.53 62.48,30.08 61.98,29.58 54.61,29.58 54.48,29.45 | 94.93,19.26 U5.4 94.51,18.16 | ISP.6 45.85,10.76 | C3.2 55.48,12.54 54.99,12.05 C2.2 54.88,11.16 54.1,11.16 53.47,10.53
  Top 1.016: 91.3,25.85 D1.2 91.3,24.93 C5.2 | 92.92,18.06 92.77,18.2 93.41,18.83 | 94.79,23.66 C9.2 | 94.51,14.26 C8.- | 91.3,35.31 92.99,37 C7.-
  other vias: 74.9,24.82 36.4,38.8 79.3,8.5 73.9,16.1 31.62,28.62 54.09,7.69 90.57,18.81 98.61,18.91 93.27,15.13 93.18,22.66 40.88,25.62 64.61,28.11
  pour Top (isolate 0.61): 0,64.6 99.5,64.6 99.5,0.3 99.4,0.3 0,0.3
  pour Bottom (isolate 0.61): -0.5,65.5 100.6,65.5 100.6,-0.7 100.5,-0.7 -0.5,-0.7
INDG_CTL  (via drill 0.35)
  Top 0.254: U1.17 52.45,16.75 v52.4,16.7 | v47.48,16.7 47.2,16.42 R3.1
  Bottom 0.254: v52.4,16.7 v47.48,16.7
INDIGLO
  Top 1.016: CLUSTER.8 21.9,37.5 27.6,31.8 27.6,29.49 Q3.4 Q3.2
KLINE
  Top 0.254: K-LINE.3 20.82,18.05 R12.2 24.7,17.1 26,15.79 27.47,15.79 U8.4
LED1
  Top 0.254: U1.54 61.7,33.79 61.65,33.84 61.65,39.05 61,39.7 LED1.A
LED2
  Top 0.254: LED2.A 60.88,35.87 U1.55
LED_CLK
  Top 0.254: U1.6 49.87,26.38 48.49,27.76 48.49,45.4 47.5,46.38 24.32,46.38 21.9,48.8 CLUSTER.3
LED_DAT
  Top 0.254: U1.4 49.82,27.98 49.3,28.5 49.3,46.3 48.23,47.37 31.88,47.37 30.28,48.97 CLUSTER.5
LED_EN
  Top 0.254: U1.7 52.05,25.54 49.92,25.54 48.08,27.38 48.08,44.93 47.14,45.87 15.9,45.87 CLUSTER.6
LED_REG
  Top 0.254: CLUSTER.4 28.19,46.9 47.8,46.9 48.89,45.81 48.89,28.13 49.86,27.16 U1.5
LED_RES
  Top 0.254: U1.8 52.02,24.73 49.92,24.73 47.67,26.97 47.67,44.41 46.78,45.3 19.52,45.3 CLUSTER.7
MISO
  Top 0.406: U1.13 50.67,20.76 50.67,14.34 ISP.1
MOSI
  Top 0.406: ISP.4 48.39,11.92 49.68,13.22 49.68,14.69 49.66,14.72 49.66,20.81 50.42,21.58 U1.12
N$1
  Top 0.254: R2.2 41.3,18.51 41.3,20.2 42.4,21.3 42.4,26.2 42.4,26.48 42.4,27.9 40.46,29.83 Q2.1
N$2
  Top 0.254: R3.2 40.82,16.42 40.8,16.4 38.25,18.95 Q3.1
N$3
  Top 0.254: U1.62 55.3,34.16 C10.1
N$4
  Top 0.254: U7.1 21.52,26.67 R6.1
N$5
  Top 0.254: R7.1 19.65,29.3 U7.5
N$6
  Top 0.254: U7.15 4.1,35.12 USB.D+
N$7  (via drill 0.35)
  Top 0.254: U7.16 v10.81,34.48 v10.8,34.47 | v10.8,35.78 10.48,35.78 10.4,35.7 4.12,35.7 USB.D-
  Bottom 0.254: v10.8,34.47 v10.8,35.78
N$8
  Top 0.254: D3.C 10.9,29.5 11.33,29.92 U7.23
N$9
  Top 0.254: U7.22 11.43,30.57 10.9,31.1 D4.C
N$10
  Top 0.254: D3.A 8.02,28.97 R8.1
N$11
  Top 0.254: D4.A 6.45,29.53 R9.1
N$12
  Top 0.254: R13.1 LED1.C
N$13
  Top 0.254: R17.1 LED2.C
N$14
  Top 1.016: C9.1 94.93,30.67 | 94.93,30.67 L1.1 | D5.C 96.58,33.38 94.93,31.73 94.93,30.67
N$15  (via drill 0.35)
  Top 0.254: U1.42 62.28,25.56 v62.23,25.51
  Bottom 0.254: v62.23,25.51 47.55,25.51 45.43,23.39 26.76,23.39 22.16,18.79 22.16,16.02 20.82,14.68 8.79,14.68 5.53,11.42 DISPLAY.9
N$16
  Top 0.254: U4.5 72.78,17.5 C16.1 71.4,18.88 R14.2
N$17
  Top 0.254: U4.4 75.2,18.2 74.7,18.7 73.9,18.7 73.5,19.1 R15.2 74.27,20.42 75.1,20.42 75.12,20.44 C15.2
N$18  (via drill 0.35)
  Top 0.254: U1.41 61.6,24.78 v61.57,24.75
  Bottom 0.254: v61.57,24.75 47.37,24.75 45.58,22.96 26.93,22.96 22.57,18.6 22.57,15.83 21.01,14.27 10.73,14.27 8.03,11.57 8.03,10.89 DISPLAY.8
N$19  (via drill 0.35)
  Top 0.254: U1.40 62.42,23.96 v62.33,24.05
  Bottom 0.254: v62.33,24.05 47.26,24.05 45.73,22.52 27.06,22.52 22.97,18.43 22.97,15.64 21.2,13.87 12.82,13.87 10.61,11.66 DISPLAY.7
N$20  (via drill 0.35)
  Top 0.254: U1.39 61.68,23.18 v61.54,23.32
  Bottom 0.254: v61.54,23.32 47.1,23.32 45.9,22.11 27.23,22.11 23.38,18.26 23.38,15.46 21.38,13.46 14.8,13.46 13.13,11.79 DISPLAY.6
N$21  (via drill 0.35)
  Top 0.254: U1.38 62.24,22.36 v62.23,22.35
  Bottom 0.254: v62.23,22.35 46.74,22.35 46.1,21.71 27.4,21.71 23.79,18.09 23.79,15.28 21.56,13.05 16.9,13.05 15.69,11.84 DISPLAY.5
N$22  (via drill 0.35)
  Top 0.254: U1.37 61.62,21.58 v61.54,21.66
  Bottom 0.254: v61.54,21.66 46.63,21.66 46.27,21.3 27.64,21.3 24.19,17.87 24.19,15.07 21.77,12.65 19.06,12.65 18.23,11.82 DISPLAY.4
N$23  (via drill 0.35)
  Top 0.254: U1.36 62.3,20.76 v62.2,20.86
  Bottom 0.254: v62.2,20.86 v62.19,20.87 27.83,20.87 24.6,17.64 24.6,14.85 20.77,11.02 DISPLAY.3
N$24  (via drill 0.35)
  Top 0.254: U1.35 65.06,19.98 v65.04,20
  Bottom 0.254: v65.04,20 64.88,20.16 61.81,20.16 61.52,20.45 28.02,20.45 25,17.43 25,14.56 23.31,12.87 DISPLAY.2
NDL_CTL  (via drill 0.35)
  Top 0.254: U1.16 53.42,18.38 v53.5,18.3 | v47.5,18.4 44.27,18.4 R2.1
  Bottom 0.254: v53.5,18.3 53.4,18.4 v47.5,18.4
NEEDLE
  Top 1.016: CLUSTER.9 26.09,38.16 Q2.4 Q2.2
O2  (via drill 0.35)
  Top 0.254: U3.4 73.3,9.37 73.04,9.63 73.04,10.56 v73,10.6
  Bottom 0.254: SENSORS.2 71.67,47.23 71.69,47.22 71.69,11.91 v73,10.6
OIL_P
  Top 0.254: U3.6 78.15,12.45 78.15,42.45 77.11,43.49 SENSORS.6
OIL_T  (via drill 0.35)
  Top 0.254: U3.5 73.8,9.8 v73.7,9.9
  Bottom 0.254: SENSORS.3 76.24,46.85 76.24,12.44 v73.7,9.9
RESET
  Top 0.406: ISP.5 47.09,12.84 47.09,10.93 47.75,10.27 47.75,10.25 49.23,10.25 | 49.23,10.25 R1.1 | U1.20 56.08,15.4 53.6,15.4 52.48,14.28 52.48,13.6 51.66,12.79 50.42,12.79 49.68,12.05 49.68,10.64 49.29,10.25 49.23,10.25
RX  (via drill 0.35)
  Top 0.254: U1.2 50.76,29.58 v50.74,29.56 | v24.68,27.66 23.69,26.67 23.28,26.67 R6.2
  Bottom 0.254: v50.74,29.56 50.73,29.54 44.49,29.54 UART.2 44.3,30.26 27.26,30.26 24.68,27.68 v24.68,27.66
RX1  (via drill 0.35)
  Top 0.152: U1.27 61.7,17.99 v61.77,18.07
  Top 0.254: v36.9,15 v36.89,15 35.5,15 34.6,15.89 U8.5
  Bottom 0.254: v36.9,15 37.1,15.2 60.34,15.2 61.77,16.63 v61.77,18.07
SCK
  Top 0.406: U1.11 52.05,22.34 49.91,22.34 48.39,20.81 ISP.3
SCL  (via drill 0.35)
  Top 0.254: 61.78,10.92 U2.6 63.12,10.9 v65.7,10.9 | 61.78,10.92 61.41,11.29 61.41,12.77 60.1,14.09 U1.25 60.1,27.29 v60.5,27.69 | v70.9,12.9 71.75,12.9 71.8,12.85 U3.10 71.8,13.5 72.8,14.5 U4.6 | 61.78,10.92 61.78,10.58 61.4,10.2 61.4,9.2 60.55,8.35 R10.1
  Bottom 0.254: v65.7,10.9 68.9,10.9 v70.9,12.9 | v60.5,27.69 60.5,37.08 60.52,37.08 54.1,43.49 OLED/I2C.3
SDA  (via drill 0.35)
  Top 0.254: 62.12,13.17 U2.5 64.89,12.19 65.8,13.1 69.5,13.1 70.24,12.36 70.24,12.03 70.8,11.47 72.17,11.47 72.3,11.61 U3.9 72.37,12.52 72.37,13.07 72.91,13.6 75,13.6 75.2,13.8 U4.7 | 62.12,13.17 60.88,14.4 U1.26 60.88,26.61 v61.25,26.98 | R11.1 62.12,13.17
  Bottom 0.254: v61.25,26.98 61.7,27.43 61.7,39.78 OLED/I2C.4
TX  (via drill 0.35)
  Top 0.254: U1.3 50.12,28.76 v50.1,28.75 | v25.99,27.5 25.99,27.6 24.49,29.1 23.55,29.1 R7.2
  Bottom 0.254: v50.1,28.75 45.73,28.75 UART.3 25.99,27.52 v25.99,27.5
TX1  (via drill 0.35)
  Top 0.152: U1.28 62.48,17.71 v62.92,18.15
  Top 0.254: v35.6,16.2 35.6,16.4 34.84,17.16 U8.6
  Bottom 0.254: v62.92,18.15 62.92,18.39 62.55,18.76 61.26,18.76 60.8,18.3 60.8,16.9 59.71,15.81 35.99,15.81 v35.6,16.2
V_SENS
  Top 0.254: U1.51 64.08,32.78 64.54,33.24 64.54,34.4 | 64.54,34.4 R4.2 | R5.2 64.23,34.4 64.54,34.4
VCC  (via drill 0.35)
  Top 0.254: R9.2 R8.2 5.85,26.3 v7.5,26.3 | C11.1 16.97,33.95 17,33.92 16.44,33.36 | 16.44,33.36 15.58,32.5 12.5,32.5 12.47,32.52 U7.19 U7.20 | U7.4 18.17,28.62 v17.6,29.2 | v17.6,32.2 16.44,33.36 | C12.1 64.6,6.88 U2.8 | 76.7,19.42 C14.2 | U4.1 76.7,18.42 76.79,18.51 v77.42,18.51 | 85.89,16.55 v85.87,16.57 | C13.1 72.93,11.38 72.8,11.5 U3.8 | R10.2 60.4,6.55 60.4,4.6 | R11.2 65.85,15.2 v66.2,15.2 | U4.2 76.2,18.1 76.7,18.6 76.7,18.56 76.65,18.51 | v36,17.5 35.1,18.4 33.06,18.4 U8.7 32.13,18.43 31.27,17.57 | 31.27,17.57 C21.1 | v27.19,26.31 29.56,23.94 29.56,19.29 31.27,17.57
  Top 0.406: C3.1 53.61,13.59 54.61,14.59 56.13,14.59 56.9,15.35 U1.21 v56.9,18.9 56.9,24.36 53.7,27.56 v53.7,28.71 U1.64 52.5,33.18 52.5,34.29 C4.1 | U1.52 63.3,29.7 62.36,28.76 55.57,28.76 v55.5,28.69 | v77.42,18.51 76.65,18.51 | 76.7,18.6 76.7,19.42 | U5.3 85.89,16.55 | C13.1 75.13,11.34 C8.+ 77.54,11.34 v77.5,11.3
  Top 0.61: C3.1 51.83,11.54 ISP.2 | C12.1 64.6,4.7 64.7,4.6 | C4.1 52.32,34.4 v50.8,34.4 | C11.1 19.8,37.1 25.5,31.4 v25.5,31.3 | DISPLAY.1 39.21,10.85 42.32,7.75 51.45,7.75 51.54,7.66
  Top 0.813: ISP.2 50.91,11.52 50.91,8.78 R1.2 50.93,8.27 51.54,7.66 54.6,4.6 60.4,4.6 64.7,4.6 82.77,4.6 C8.+
  Top 1.016: U5.3 89.12,14.65 89.12,14.27 C6.1 88.96,14.26 88.96,14.12 88.89,11.96 C8.+
  Bottom 0.254: v17.6,32.2 v17.6,29.2 17.33,29.2 14.44,26.31 | 14.44,26.31 7.51,26.31 v7.5,26.3 | v66.2,15.2 66.2,16.2 63.19,19.21 57.21,19.21 v56.9,18.9 | v27.19,26.31 14.44,26.31
  Bottom 0.406: v55.5,28.69 53.72,28.69 v53.7,28.71 | v85.87,16.57 83.93,18.51 v77.42,18.51
  Bottom 0.61: v50.8,34.4 46.3,34.4 UART.1 43.2,31.3 v25.5,31.3
VCC2  (via drill 0.6)
  Top 0.406: OLED/I2C.1 BUTTONS.3
  Top 0.813: U6.3 80.02,31.49 79.3,30.77 79.3,22 82,19.3 C17.+ 82,19.81 83.37,21.18 v83.37,21.43 | CLUSTER.1 C20.+
  Bottom 0.254: 59.28,63.48 59.28,63.56 59.3,63.58
  Bottom 0.406: 59.28,63.58 59.28,63.48 59.28,54.48 OLED/I2C.1
  Bottom 0.813: v83.37,21.43 98.17,36.23 98.17,61.73 96.32,63.58 59.28,63.58 | CLUSTER.1 28.1,63.58 59.3,63.58
VIN
  Top 0.254: R4.1 64.54,41.37 63.36,42.55 63.36,46.57 84.84,46.57 86,47.72 POWER.2
  Top 1.016: D5.A 93.33,49 POWER.2
VPP
  Top 0.813: 85.21,34.99 85.21,33.32 84.64,32.75 U6.1 | 85.21,34.99 C18.+ 85.2,35 88.05,35 | C19.1 85.21,38.39 85.21,34.99
  Top 1.016: U5.1 87.42,21.11 88.03,21.73 C5.1 88.02,26.2 | C7.+ 88.05,36.55 88.05,35 L1.2 88.05,26.22 88.02,26.2 | 88.02,26.2 D1.1
VSS  (via drill 0.35)
  Top 0.254: D2.A 70.3,15.51 v70.3,38.5
  Bottom 0.254: SENSORS.1 67.8,46.91 67.8,43.2 70.4,40.6 70.4,38.6 v70.3,38.5
VSS_IN  (via drill 0.35)
  Top 0.254: U1.15 54.26,19.16 v54.3,19.2 | v67.2,16.6 67.83,15.97 D2.C
  Bottom 0.254: v54.3,19.2 54.78,19.68 64.12,19.68 v67.2,16.6
XTAL1
  Top 0.254: Q1.3 60,11.89
  Top 0.406: U1.24 59.28,12.6 60,11.89 58.95,10.83 58.95,9.03 C1.2
XTAL2
  Top 0.406: U1.23 58.5,13.6 57.86,12.97 56.92,12.97 56.39,12.43 56.39,10.01 | Q1.1 56.39,10.01 | C2.1 55.91,9.53 56.39,10.01

### Text on the board
tNames: ATMEGA2561 | Honda Prelude IV / Gauge and Cluster controller / Version 2.0 / HW 2.01